# Altium schematic sheet BaiguangESI.SchDoc: BaiguangESI
size A4; Author: Lordz Zidel; CompanyName: T.WKVER; DrawnBy: Lordz Zidel; Engineer: Lordz Zidel; Organization: T.WKVER; Revision: v0p1_LTE; DocumentName: BaiguangESI; ProjectName: BaiguangESI
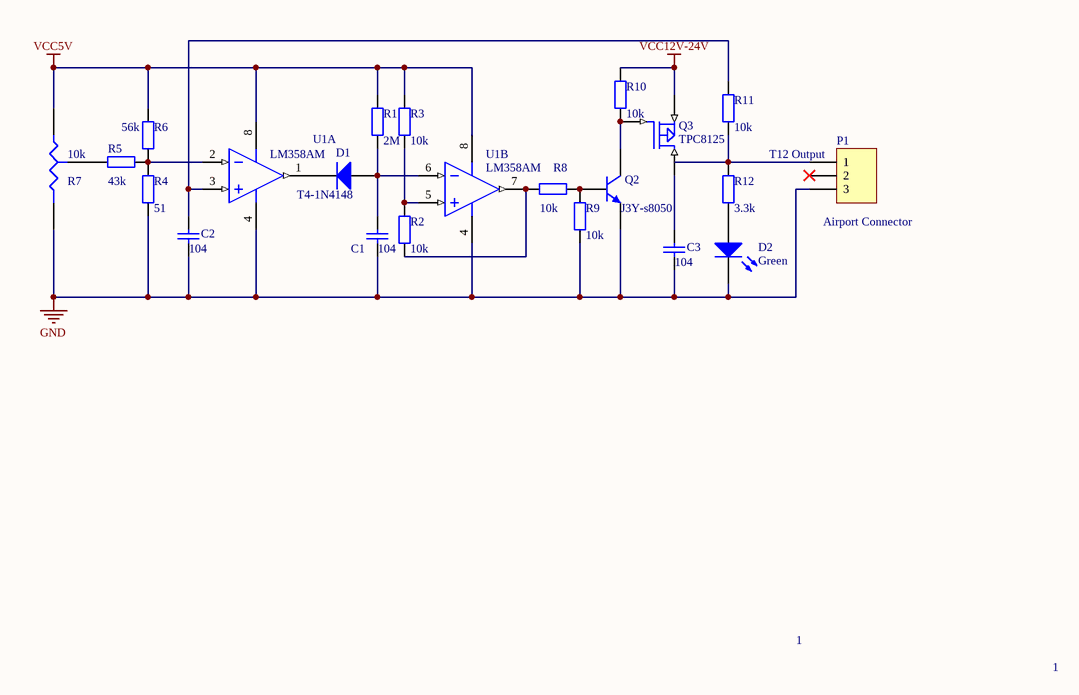
[diagram p0: BaiguangESI.SchDoc]

## Parts
C1  value 104  [RAD-0.3]
C2  value 104  [RAD-0.3]
C3  value 104  [RAD-0.3]
D1  T4-1N4148  [SMC]
D2  Green  [LED-0]
P1  Airport Connector  [HDR1X3]
Q2  J3Y-s8050  [TO-92A]
Q3  TPC8125
R1  value 2M  [AXIAL-0.4]
R2  value 10k  [AXIAL-0.4]
R3  value 10k  [AXIAL-0.4]
R4  value 51  [AXIAL-0.4]
R5  value 43k  [AXIAL-0.4]
R6  value 56k  [AXIAL-0.4]
R7  value 10k  [VR3]
R8  value 10k  [AXIAL-0.4]
R9  value 10k  [AXIAL-0.4]
R10  value 10k  [AXIAL-0.4]
R11  value 10k  [AXIAL-0.4]
R12  value 3.3k  [AXIAL-0.4]
U1  LM358AM  [M08A_N]  (parts A,B of 2)

## Nets
GND: C1.1 C2.1 C3.1 D2.2(K) P1.3 Q2.1(E) R4.1 R7.2(B) R9.2 U1.4(GND)
VCC5V: R1.2 R3.2 R6.2 R7.1(A) U1.8(V+)
VCC12V-24V: Q3.3(S) R10.1
NetC1_2: C1.2 D1.1(A) R1.1 U1.6(INB-)
NetC2_2: C2.2 R11.2 U1.3(INA+)
NetC3_2: C3.2 Q3.2(D)
NetD1_2: D1.2(K) U1.1(OUTA)
NetD2_1: D2.1(A) R12.2
NetP1_1: P1.1 R11.1 R12.1
NetQ2_2: Q2.2(B) R8.1 R9.1
NetQ2_3: Q2.3(C) Q3.1(G) R10.2
NetR2_1: R2.1 R8.2 U1.7(OUTB)
NetR2_2: R2.2 R3.1 U1.5(INB+)
NetR4_2: R4.2 R5.1 R6.1 U1.2(INA-)
NetR5_2: R5.2 R7.3(TAP)

Not connected (* = marked no-connect by the designer): P1 2*

## Notes on the sheet
- (near P1) T12 Output
- 1

## Library data of the parts
C1-C3 = Cap: Capacitor; Published: 8-Jun-2000; LatestRevisionDate: 17-Jul-2002; LatestRevisionNote: Re-released for DXP Platform.; PackageReference: RAD-0.3; Publisher: Altium Limited; PackageDescription: Radial Cap, Thru-Hole; 2 Leads; 0.3 in Pin Spacing
D1 = Diode: Default Diode; Published: 8-Jun-2000; LatestRevisionDate: 17-Jul-2002; LatestRevisionNote: Re-released for DXP Platform.; PackageVersion: Sep-1996; PackageReference: SMC; Publisher: Altium Limited; PackageDescription: DO-214-AB/SMC; 2 C-Bend Leads; Body 7.9 x 5.9 mm, inc. leads (LxW); Code_JEDEC: DO-214-AB
D2 = LED0: Typical INFRARED GaAs LED; Published: 8-Jun-2000; LatestRevisionDate: 08-Jul-2005; LatestRevisionNote: Mech Layer 1 removed.; PackageReference: LED-0; Publisher: Altium Limited; PackageDescription: LED; 2 Leads
P1 = Header 3: Header, 3-Pin; LatestRevisionDate: 17-Jul-2002; LatestRevisionNote: Re-released for DXP Platform.; Publisher: Altium Limited
Q2 = 2N3904: NPN General Purpose Amplifier; Published: 8-Jun-2000; LatestRevisionDate: 15-Jan-2003; LatestRevisionNote: PCB Footprint 'BCY-W3/D4.7' replaced; DatasheetVersion: 1997; PackageVersion: Sep-1998; PackageReference: TO-92A; Publisher: Altium Limited; PackageDescription: TO, Flat Index; 3 In-Line, Axial Leads; Body Dia. 4.5mm; Leads 0.51 x 0.48 mm (max); ComponentLink1Description: Manufacturer Link; ComponentLink1URL: http://www.fairchildsemi.com/; ComponentLink2Description: Datasheet; ComponentLink2URL: http://www.fairchildsemi.com/ds/2N%2F2N3904.pdf
Q3 = MOSFET P
R1-R6 R8-R12 = Res2: Resistor; Published: 8-Jun-2000; LatestRevisionDate: 17-Jul-2002; LatestRevisionNote: Re-released for DXP Platform.; PackageReference: AXIAL-0.4; Publisher: Altium Limited; PackageDescription: Axial Device, Thru-Hole; 2 Leads; 0.4 in Pin Spacing
R7 = Res Tap: Tapped Resistor; Sim Note: Enter the Resistance value and the set point into parameter fields.; Set Position: 0.5; Published: 24-Mar-1999; LatestRevisionDate: 17-Jul-2002; LatestRevisionNote: Re-released for DXP Platform.; PackageReference: VR3; Publisher: Altium Limited; PackageDescription: Variable Resistor, Thru-Hole; 3 Leads
U1 = LM358AM: Low Power Dual Operational Amplifier, 8-pin Narrow SOIC; Manufacturer: National Semiconductor; PackageTopMarking: NSZXTT*LM*358AM; PowerWise: N; CompType: Amplifiers; Published: 4-Dec-2008; LatestRevisionDate: 13-Jan-2009; LatestRevisionNote: Sim Model Added.; DatasheetVersion: Oct-2005; PackageVersion: revM, May-2009; PackageReference: M08A; Publisher: Altium Limited; PackageDescription: SOIC Narrow, 4.9 x 3.9 x 1.45mm, 8 Lead, 1.27mm Pitch; Supplier 1: Farnell; Supplier Part Number 1: 9486801; PartNumber: LM358AM; RoHS: N; PinCount: 8; Code_JEDEC: MS-012-AA; Code_IPC: SOIC127P600-8; ComponentLink1Description: LM358 Datasheet; ComponentLink1URL: http://www.national.com/ds/LM/LM358.pdf; ComponentLink2Description: LM358 Web Page; ComponentLink2URL: http://www.national.com/pf/LM/LM358.html; ComponentLink3Description: M08A Package Page; ComponentLink3URL: http://www.national.com/packaging/folders/m08a.html